# Altium schematic sheet 200_DCDC_5V-3V3.SchDoc
size A; SheetNumber: 3; SheetTotal: 3
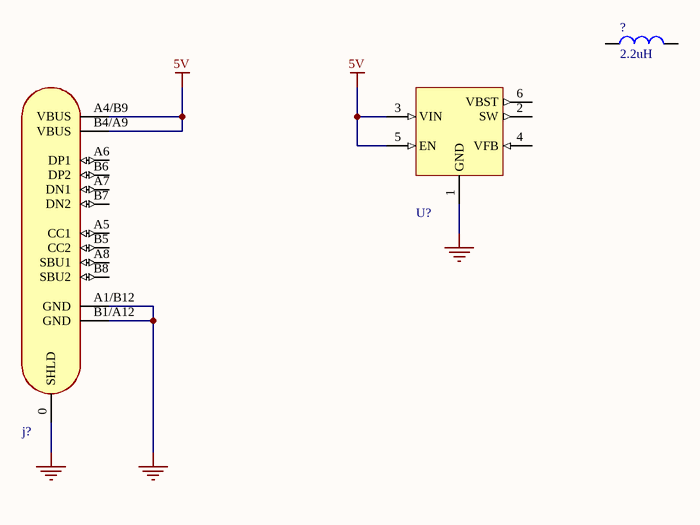
[diagram p0: 200_DCDC_5V-3V3.SchDoc]

## Parts
?  value 2.2uH  [Ind_5.8*5.2_NS]  (hidden comment: 2.2uH 4A)
j?  USB C  [CON_USB_C_16P_RA]  (value not drawn)
U?  TPS564201DDCR  [SOT_23_6]  (value not drawn)

## Nets
5V: j?.A4/B9(VBUS) j?.B4/A9(VBUS) U?.3(VIN) U?.5(EN)
GND: j?.0(SHLD) j?.A1/B12(GND) j?.B1/A12(GND) U?.1(GND)

Not connected (* = marked no-connect by the designer): ? 1 2; j? A5(CC1) A6(DP1) A7(DN1) A8(SBU1) B5(CC2) B6(DP2) B7(DN2) B8(SBU2); U? 2(SW) 4(VFB) 6(VBST)

## Library data of the parts
? = Inductor_2.2uH_4A_5.8*5.2mm: 4A 2.2uH ±20% 22.1mΩ SMD,5.8x5.2mm Inductors (SMD) ROHS; Manufacturer: SHOU HAN; Manufacturer Part Number: CY54-2.2UH; Supplier 1: LCSC; Supplier Part Number 1: C2929427; ComponentLink1Description: LCSC; ComponentLink1URL: https://lcsc.com/product-detail/Inductors-SMD_SHOU-HAN-CY54-2-2UH_C2929427.html
j? = CON_USB_TYPEC_16P: 3A USB 3.1 1 Surface Mount 16P Female -40℃~+85℃ Type-C SMD USB Connectors ROHS; Manufacturer: SHOU HAN; Manufacturer Part Number: TYPE-C-3.1-16PIN; Supplier 1: LCSC; Supplier Part Number 1: C7507405; ComponentLink1Description: LCSC; ComponentLink1URL: https://lcsc.com/product-detail/USB-Connectors_SHOU-HAN-TYPE-C-3-1-16PIN_C7507405.html
U? = DCDC_SW_BUCK_4A_SOT23-6: IC REG BUCK ADJ 4A SOT23; Manufacturer: Texas Instruments; Manufacturer Part Number: TPS564201DDCR; Supplier 1: LCSC; Supplier Part Number 1: C464812; ComponentLink1Description: LCSC; ComponentLink1URL: https://lcsc.com/product-detail/DC-DC-Converters_Texas-Instruments-TPS564201DDCR_C464812.html